# Altium schematic sheet Entrada_comestero_rm5.SchDoc: CONTROLADORA MAIS PIPOCA - REVISÃO EMC
size A3; DocumentNumber: GA0050; SheetNumber: 12; SheetTotal: 17
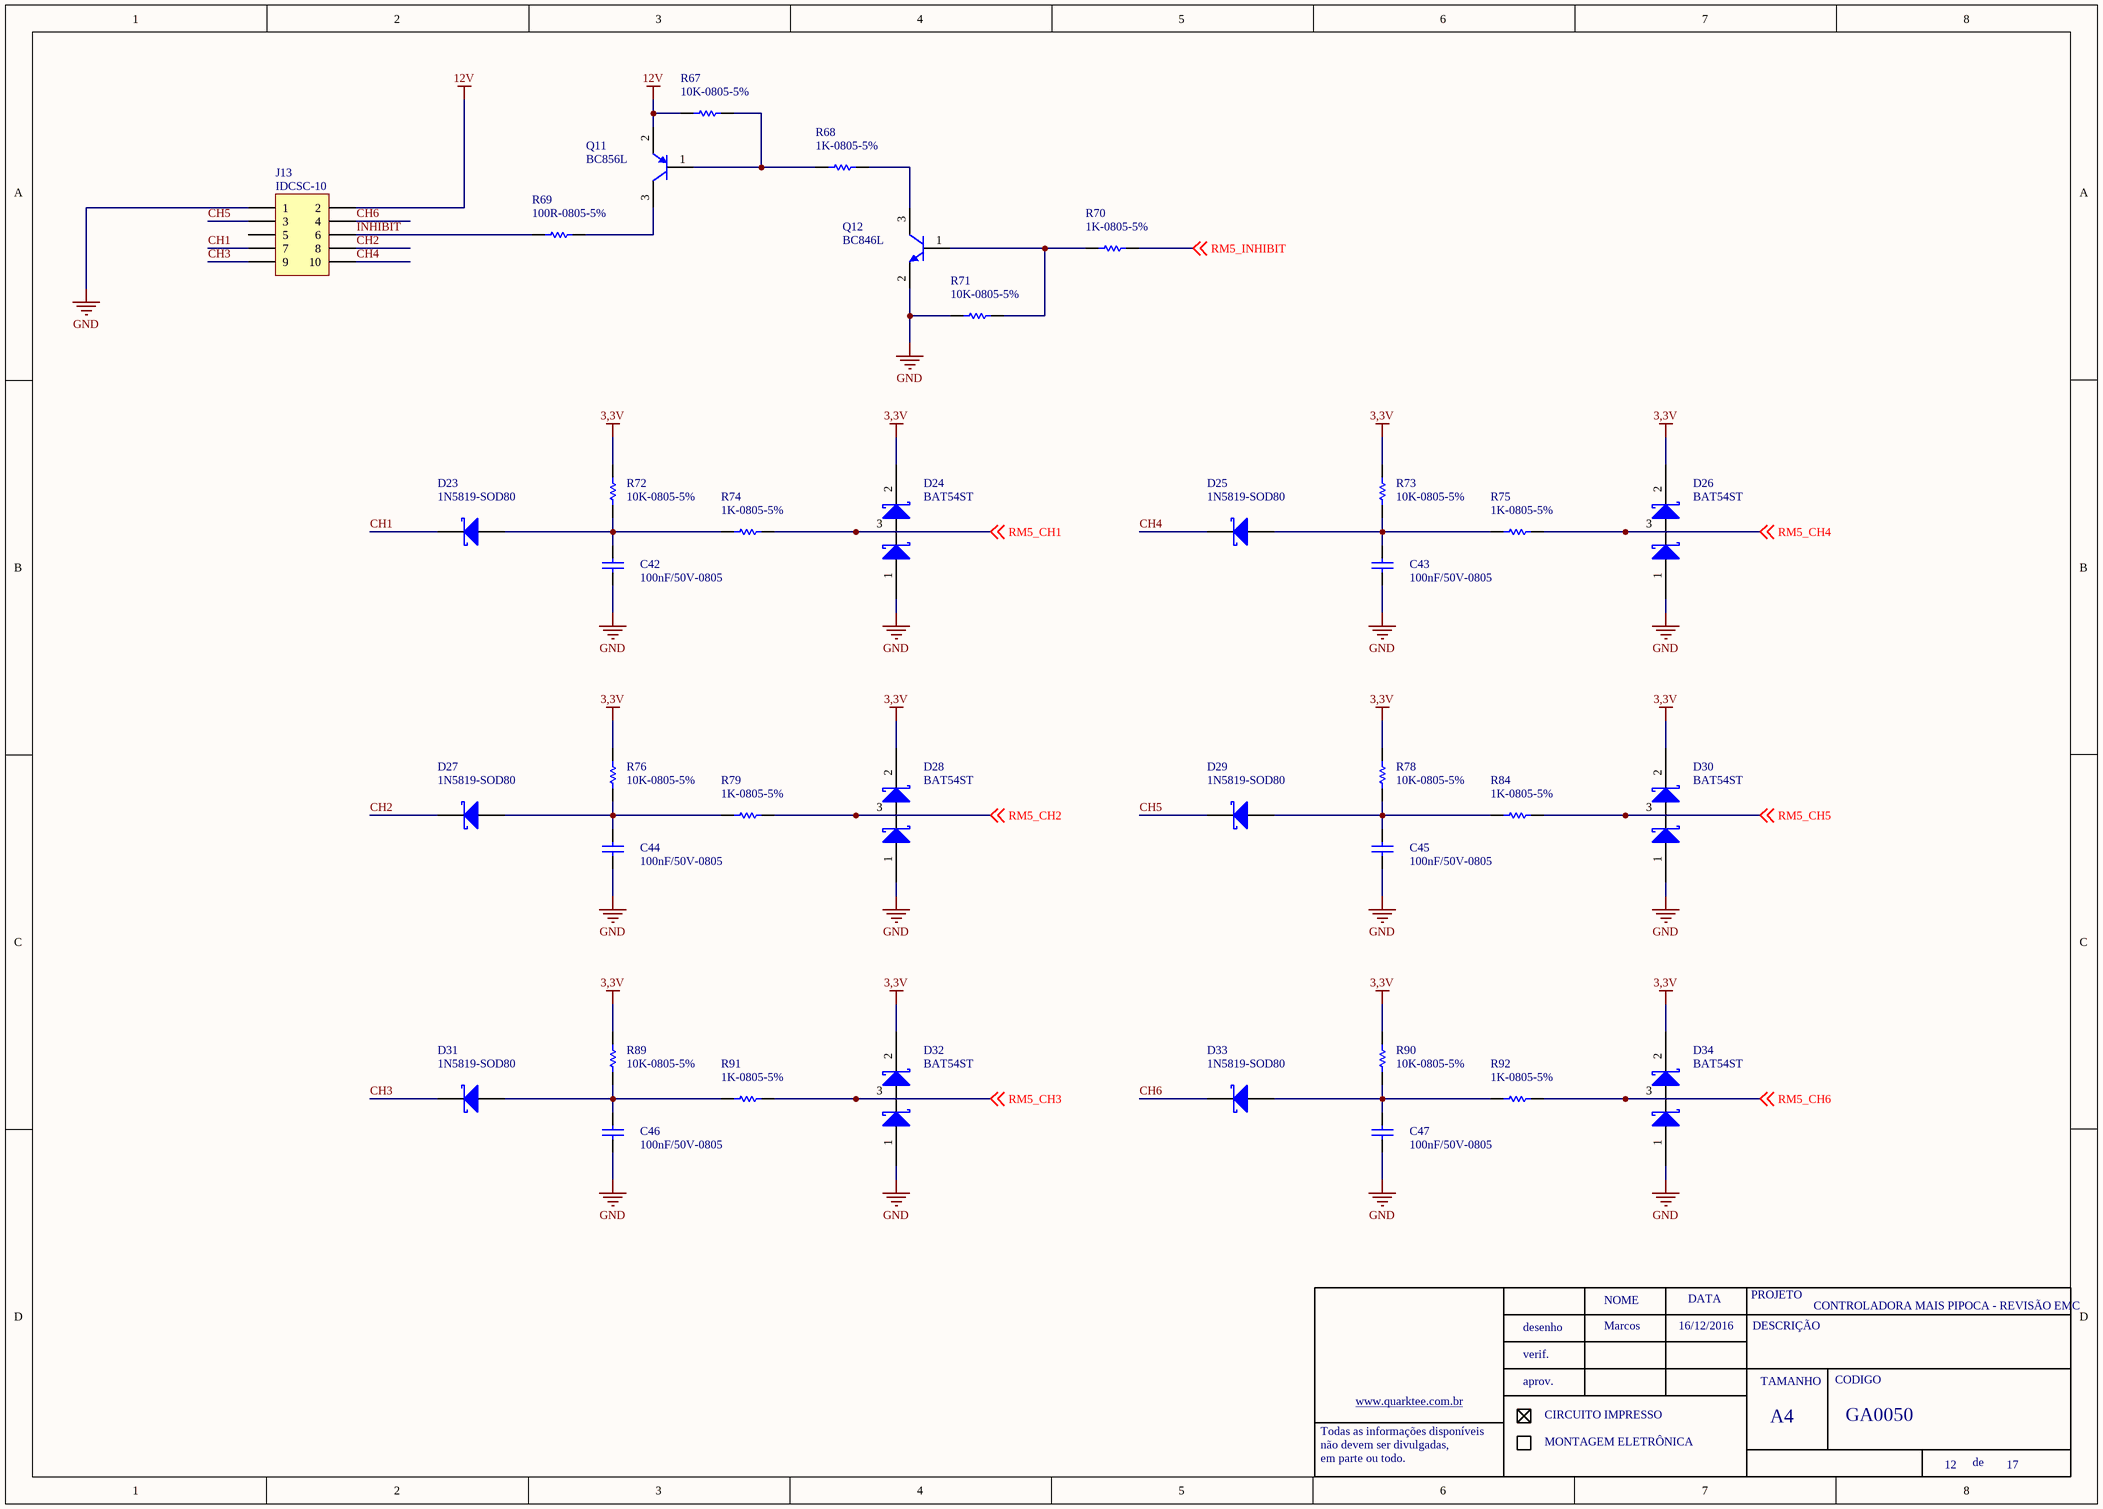
[diagram p0: Entrada_comestero_rm5.SchDoc]

## Parts
C42  100nF/50V-0805  [0805-REVISADO ONDA]
C43  100nF/50V-0805  [0805-REVISADO ONDA]
C44  100nF/50V-0805  [0805-REVISADO ONDA]
C45  100nF/50V-0805  [0805-REVISADO ONDA]
C46  100nF/50V-0805  [0805-REVISADO ONDA]
C47  100nF/50V-0805  [0805-REVISADO ONDA]
D23  1N5819-SOD80  [MINIMLEF/SOD80 - REVISADO ONDA]
D24  BAT54ST  [SOT23 - REVISADO ONDA]
D25  1N5819-SOD80  [MINIMLEF/SOD80 - REVISADO ONDA]
D26  BAT54ST  [SOT23 - REVISADO ONDA]
D27  1N5819-SOD80  [MINIMLEF/SOD80 - REVISADO ONDA]
D28  BAT54ST  [SOT23 - REVISADO ONDA]
D29  1N5819-SOD80  [MINIMLEF/SOD80 - REVISADO ONDA]
D30  BAT54ST  [SOT23 - REVISADO ONDA]
D31  1N5819-SOD80  [MINIMLEF/SOD80 - REVISADO ONDA]
D32  BAT54ST  [SOT23 - REVISADO ONDA]
D33  1N5819-SOD80  [MINIMLEF/SOD80 - REVISADO ONDA]
D34  BAT54ST  [SOT23 - REVISADO ONDA]
J13  IDCSC-10  [IDCSC-10]
Q11  BC856L  [SOT23 - REVISADO ONDA]
Q12  BC846L  [SOT23 - REVISADO ONDA]
R67  10K-0805-5%  [0805-REVISADO ONDA]
R68  1K-0805-5%  [0805-REVISADO ONDA]
R69  100R-0805-5%  [0805-REVISADO ONDA]
R70  1K-0805-5%  [0805-REVISADO ONDA]
R71  10K-0805-5%  [0805-REVISADO ONDA]
R72  10K-0805-5%  [0805-REVISADO ONDA]
R73  10K-0805-5%  [0805-REVISADO ONDA]
R74  1K-0805-5%  [0805-REVISADO ONDA]
R75  1K-0805-5%  [0805-REVISADO ONDA]
R76  10K-0805-5%  [0805-REVISADO ONDA]
R78  10K-0805-5%  [0805-REVISADO ONDA]
R79  1K-0805-5%  [0805-REVISADO ONDA]
R84  1K-0805-5%  [0805-REVISADO ONDA]
R89  10K-0805-5%  [0805-REVISADO ONDA]
R90  10K-0805-5%  [0805-REVISADO ONDA]
R91  1K-0805-5%  [0805-REVISADO ONDA]
R92  1K-0805-5%  [0805-REVISADO ONDA]

## Nets
3,3V: D24.2 D26.2 D28.2 D30.2 D32.2 D34.2 R72.2 R73.2 R76.2 R78.2 R89.2 R90.2
12V: J13.2 Q11.2(E) R67.1
GND: C42.1 C43.1 C44.1 C45.1 C46.1 C47.1 D24.1 D26.1 D28.1 D30.1 D32.1 D34.1 J13.1 Q12.2(E) R71.1
CH1: D23.2(K) J13.7
CH2: D27.2(K) J13.8
CH3: D31.2(K) J13.9
CH4: D25.2(K) J13.10
CH5: D29.2(K) J13.3
CH6: D33.2(K) J13.4
INHIBIT: J13.6 R69.1
RM5_CH1: D24.3 R74.2 ; off-sheet RM5_CH1
RM5_CH2: D28.3 R79.2 ; off-sheet RM5_CH2
RM5_CH3: D32.3 R91.2 ; off-sheet RM5_CH3
RM5_CH4: D26.3 R75.2 ; off-sheet RM5_CH4
RM5_CH5: D30.3 R84.2 ; off-sheet RM5_CH5
RM5_CH6: D34.3 R92.2 ; off-sheet RM5_CH6
RM5_INHIBIT: R70.2 ; off-sheet RM5_INHIBIT
NetC42_2: C42.2 D23.1(A) R72.1 R74.1
NetC43_2: C43.2 D25.1(A) R73.1 R75.1
NetC44_2: C44.2 D27.1(A) R76.1 R79.1
NetC45_2: C45.2 D29.1(A) R78.1 R84.1
NetC46_2: C46.2 D31.1(A) R89.1 R91.1
NetC47_2: C47.2 D33.1(A) R90.1 R92.1
NetQ11_1: Q11.1(B) R67.2 R68.1
NetQ11_3: Q11.3(C) R69.2
NetQ12_1: Q12.1(B) R70.1 R71.2
NetQ12_3: Q12.3(C) R68.2

Not connected (* = marked no-connect by the designer): J13 5

## Notes on the sheet
- Marcos
- 16/12/2016
- NOME
- DATA
- PROJETO
- DESCRIÇÃO
- desenho
- verif.
- aprov.
- TAMANHO
- CODIGO
- Todas as informações disponíveis
- não devem ser divulgadas,
- em parte ou todo.
- www.quarktee.com.br
- CIRCUITO IMPRESSO
- MONTAGEM ELETRÔNICA
- A4
- de

## Library data of the parts
C42-C47 = 100nF/50-0805-NPO: ERP: 104.11.005
D24 D26 D28 D30 D32 D34 = BA54
J13 = IDCSN: CONECTOR HEADER 10 VIAS 90º; ERP: 435.00.009
Q12 = BC846: ERP: 106.22.001
R70 = 100R-0805-5%: ERP: 102.11.031
D23 D25 D27 D29 D31 D33 = 1N5819-SOD80: ERP: 121.18.003
Q11 = BC856L: ERP: 106.22.002
R67 R71-R73 R76 R78 R89 R90 = 10K-0805-5%: ERP: 102.11.054
R68 R74 R75 R79 R84 R91 R92 = 1K-0805-5%: ERP: 102.11.042
R69 = 100R-0805-5%: ERP: 102.11.031